# Altium schematic sheet Fly_Buck_Power_Supply_for_Inverter.SchDoc
size A0; SheetNumber: 1; SheetTotal: 1
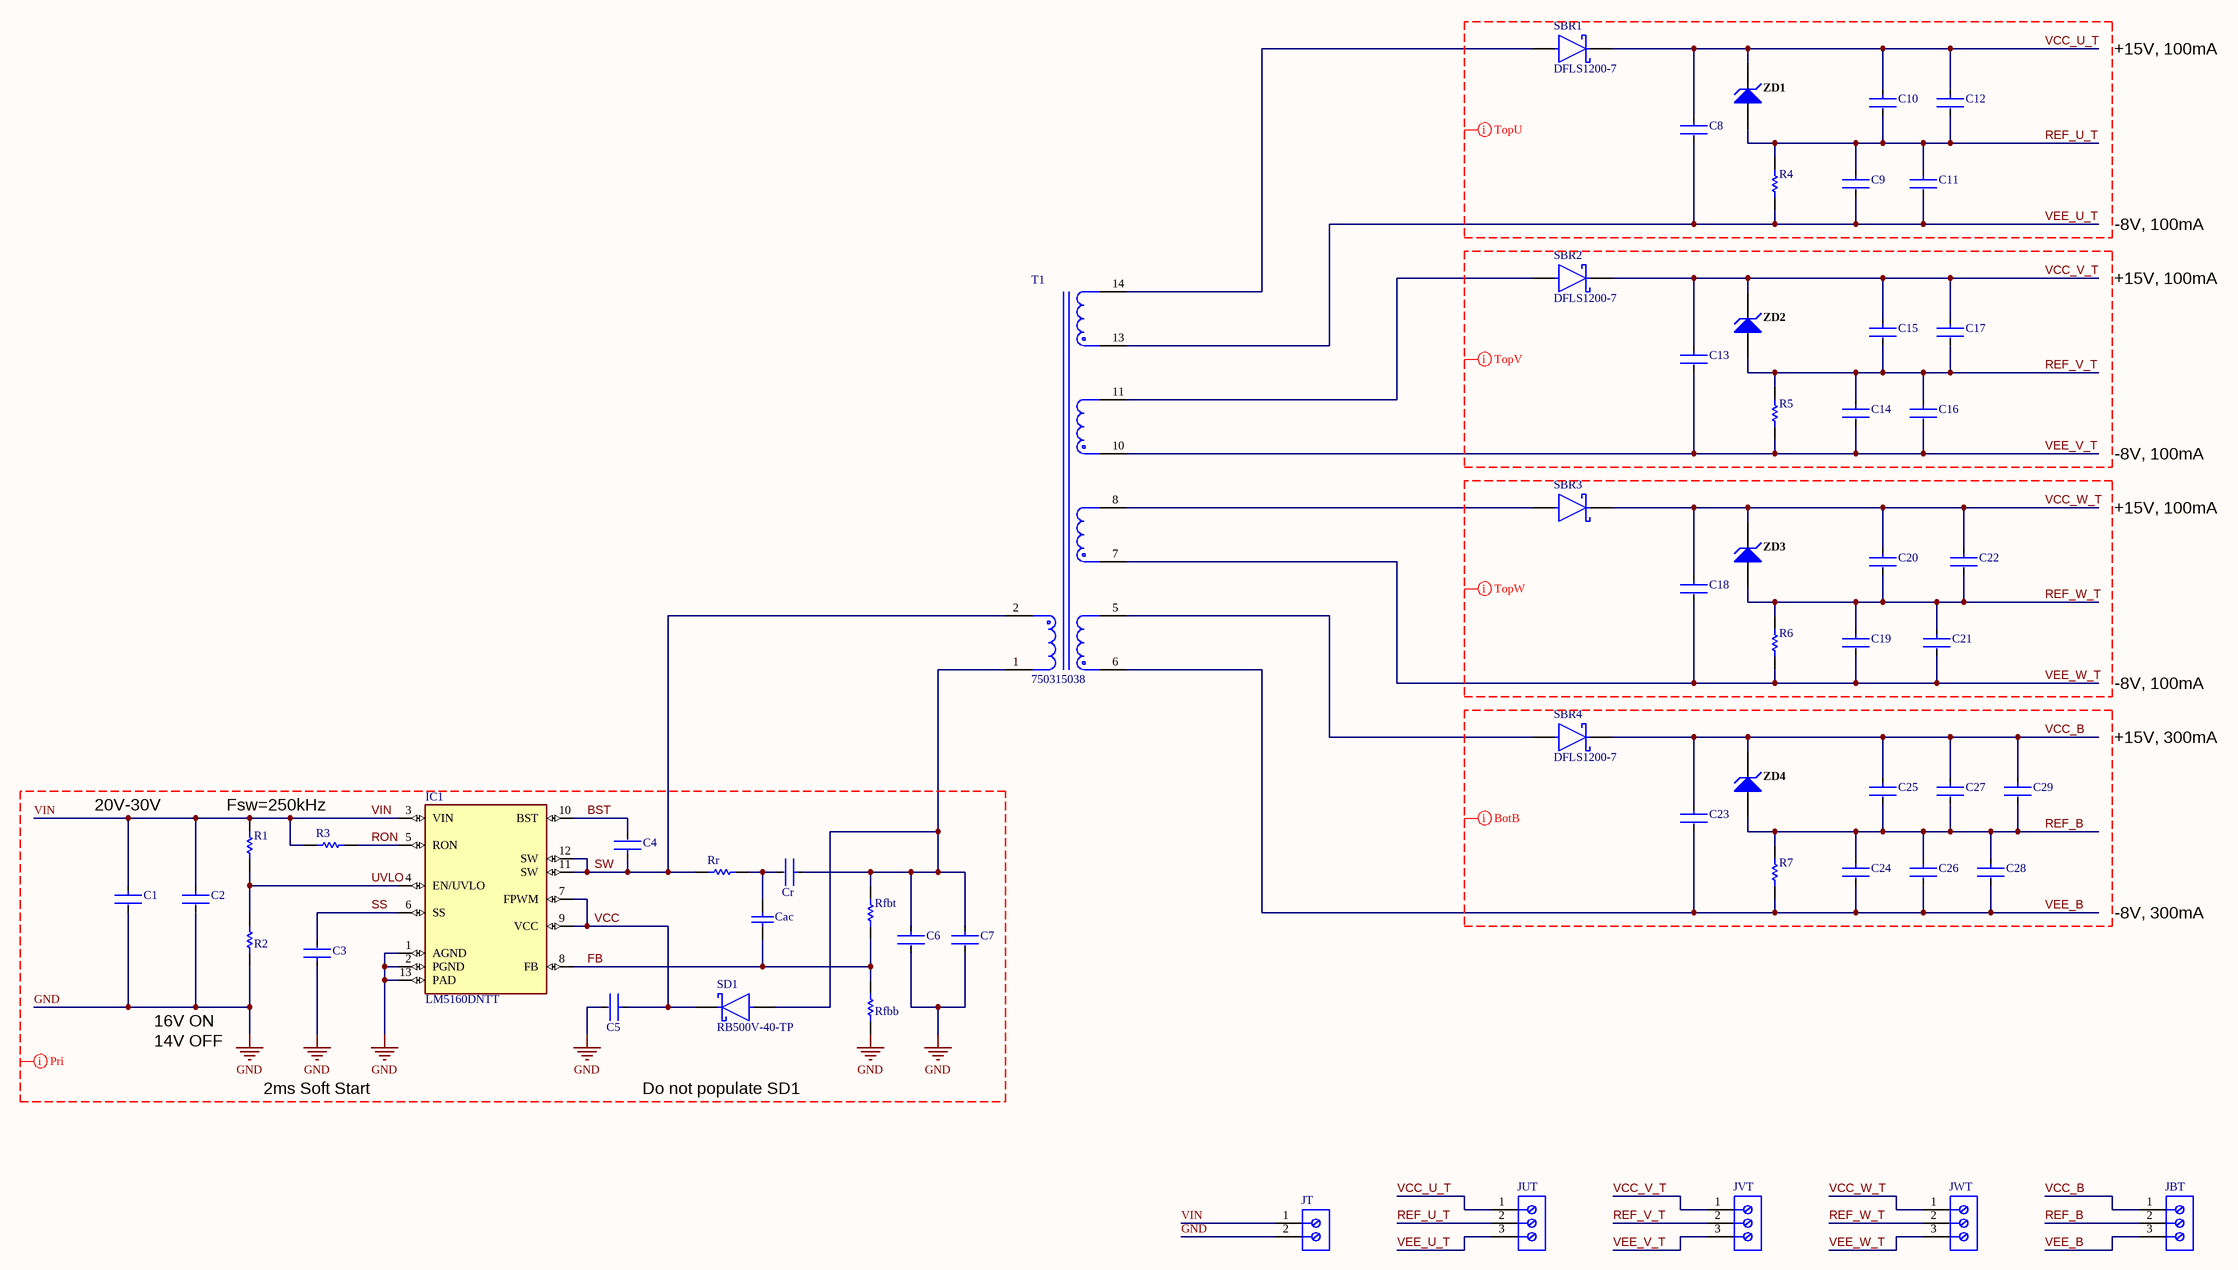
[diagram p0: Fly_Buck_Power_Supply_for_Inverter.SchDoc]

## Parts
C1  GRM32ER71H106KA12L  [FP-GRM32-MFG]  (value not drawn)
C2  C0603X104K5RACTU  [FP-C0603-CJ-MFG]  (value not drawn)
C3  C1608X7R1H103K080AA  [FP-C1608-080-0_1-MFG]  (value not drawn)
C4  C1608X7R1H103K080AA  [FP-C1608-080-0_1-MFG]  (value not drawn)
C5  C1608X5R1E105K080AC  [FP-C1608-080-0_1-MFG]  (value not drawn)
C6  GRM32ER71E226KE15L  [FP-GRM32E-0_3-0_2-IPC_B]  (value not drawn)
C7  GRM32ER71E226KE15L  [FP-GRM32E-0_3-0_2-IPC_B]  (value not drawn)
C8  GRM32ER71H106KA12L  [FP-GRM32-MFG]  (value not drawn)
C9  GRM32ER71E226KE15L  [FP-GRM32E-0_3-0_2-IPC_B]  (value not drawn)
C10  GRM32ER71E226KE15L  [FP-GRM32E-0_3-0_2-IPC_B]  (value not drawn)
C11  C0603X104K5RACTU  [FP-C0603-CJ-MFG]  (value not drawn)
C12  C0603X104K5RACTU  [FP-C0603-CJ-MFG]  (value not drawn)
C13  GRM32ER71H106KA12L  [FP-GRM32-MFG]  (value not drawn)
C14  GRM32ER71E226KE15L  [FP-GRM32E-0_3-0_2-IPC_B]  (value not drawn)
C15  GRM32ER71E226KE15L  [FP-GRM32E-0_3-0_2-IPC_B]  (value not drawn)
C16  C0603X104K5RACTU  [FP-C0603-CJ-MFG]  (value not drawn)
C17  C0603X104K5RACTU  [FP-C0603-CJ-MFG]  (value not drawn)
C18  GRM32ER71H106KA12L  [FP-GRM32-MFG]  (value not drawn)
C19  GRM32ER71E226KE15L  [FP-GRM32E-0_3-0_2-IPC_B]  (value not drawn)
C20  GRM32ER71E226KE15L  [FP-GRM32E-0_3-0_2-IPC_B]  (value not drawn)
C21  C0603X104K5RACTU  [FP-C0603-CJ-MFG]  (value not drawn)
C22  C0603X104K5RACTU  [FP-C0603-CJ-MFG]  (value not drawn)
C23  GRM32ER71H106KA12L  [FP-GRM32-MFG]  (value not drawn)
C24  GRM32ER71E226KE15L  [FP-GRM32E-0_3-0_2-IPC_B]  (value not drawn)
C25  GRM32ER71E226KE15L  [FP-GRM32E-0_3-0_2-IPC_B]  (value not drawn)
C26  GRM32ER71E226KE15L  [FP-GRM32E-0_3-0_2-IPC_B]  (value not drawn)
C27  GRM32ER71E226KE15L  [FP-GRM32E-0_3-0_2-IPC_B]  (value not drawn)
C28  C0603X104K5RACTU  [FP-C0603-CJ-MFG]  (value not drawn)
C29  C0603X104K5RACTU  [FP-C0603-CJ-MFG]  (value not drawn)
Cac  C0603X102K5RACTU  [CAPC1608X87X35NL20T15]  (value not drawn)
Cr  C1608X7R1H103K080AA  [FP-C1608-080-0_1-MFG]  (value not drawn)
IC1  LM5160DNTT  [FP-DNT0012B-IPC_B]
JBT  691214110003  [691214110003]  (value not drawn)
JT  691214110002  [691214110002]  (value not drawn)
JUT  691214110003  [691214110003]  (value not drawn)
JVT  691214110003  [691214110003]  (value not drawn)
JWT  691214110003  [691214110003]  (value not drawn)
R1  RK73H1JTTD1003F  [RESC1608X55X30ML20T10]  (value not drawn)
R2  CRCW06038K45FKEA  [RESC1609X50X30LL10T20]  (value not drawn)
R3  RC0603FR-07453RL  [RESC1608X55X25NL10T15]  (value not drawn)
R4  ERJ-6ENF5110V  [RESC2013X70X40ML20T20]  (value not drawn)
R5  ERJ-6ENF5110V  [RESC2013X70X40ML20T20]  (value not drawn)
R6  ERJ-6ENF5110V  [RESC2013X70X40ML20T20]  (value not drawn)
R7  ERJ-6ENF5110V  [RESC2013X70X40ML20T20]  (value not drawn)
Rfbb  ERA3AEB2052V  [RESC1608X55X30ML20T20]  (value not drawn)
Rfbt  ERJ-3EKF8662V  [RESC1608X55X30NL15T15]  (value not drawn)
Rr  ERA3AEB2052V  [RESC1608X55X30ML20T20]  (value not drawn)
SBR1  DFLS1200-7  [FP-PowerDI123-MFG]
SBR2  DFLS1200-7  [FP-PowerDI123-MFG]
SBR3  DFLS1200-7  [FP-PowerDI123-MFG]  (value not drawn)
SBR4  DFLS1200-7  [FP-PowerDI123-MFG]
SD1  RB500V-40-TP  [FP-SOD-323-MFG]
T1  750315038  [PCBComponent_1]
ZD1  MMSZ5245B-E3-08  [VISH-SOD-123-2_V]  (value not drawn)
ZD2  MMSZ5245B-E3-08  [VISH-SOD-123-2_V]  (value not drawn)
ZD3  MMSZ5245B-E3-08  [VISH-SOD-123-2_V]  (value not drawn)
ZD4  MMSZ5245B-E3-08  [VISH-SOD-123-2_V]  (value not drawn)

## Nets
GND: C1.2 C2.2 C3.2 C5.1 C6.2 C7.2 IC1.1(AGND) IC1.2(PGND) IC1.13(PAD) JT.2 R2.2 Rfbb.2
BST: C4.1 IC1.10(BST)
FB: Cac.2 IC1.8(FB) Rfbb.1 Rfbt.2
REF_B: C24.1 C25.2 C26.1 C27.2 C28.1 C29.2 JBT.2 R7.1 ZD4.1(A)
REF_U_T: C9.1 C10.2 C11.1 C12.2 JUT.2 R4.1 ZD1.1(A)
REF_V_T: C14.1 C15.2 C16.1 C17.2 JVT.2 R5.1 ZD2.1(A)
REF_W_T: C19.1 C20.2 C21.1 C22.2 JWT.2 R6.1 ZD3.1(A)
RON: IC1.5(RON) R3.2
SS: C3.1 IC1.6(SS)
SW: C4.2 IC1.11(SW) IC1.12(SW) Rr.1 T1.2(Secondary_Dot)
UVLO: IC1.4(EN/UVLO) R1.2 R2.1
VCC: C5.2 IC1.7(FPWM) IC1.9(VCC) SD1.1(C)
VCC_B: C23.1 C25.1 C27.1 C29.1 JBT.1 SBR4.1(C) ZD4.2(K)
VCC_U_T: C8.1 C10.1 C12.1 JUT.1 SBR1.1(C) ZD1.2(K)
VCC_V_T: C13.1 C15.1 C17.1 JVT.1 SBR2.1(C) ZD2.2(K)
VCC_W_T: C18.1 C20.1 C22.1 JWT.1 SBR3.1(C) ZD3.2(K)
VEE_B: C23.2 C24.2 C26.2 C28.2 JBT.3 R7.2 T1.6(Secondary_Dot)
VEE_U_T: C8.2 C9.2 C11.2 JUT.3 R4.2 T1.13(Secondary_Dot)
VEE_V_T: C13.2 C14.2 C16.2 JVT.3 R5.2 T1.10(Secondary_Dot)
VEE_W_T: C18.2 C19.2 C21.2 JWT.3 R6.2 T1.7(Secondary_Dot)
VIN: C1.1 C2.1 IC1.3(VIN) JT.1 R1.1 R3.1
NetC6_1: C6.1 C7.1 Cr.2 Rfbt.1 SD1.2(A) T1.1(Primary_Dot)
NetCac_1: Cac.1 Cr.1 Rr.2
NetSBR1_2: SBR1.2(A) T1.14(Primary_Dot)
NetSBR2_2: SBR2.2(A) T1.11(Primary_Dot)
NetSBR3_2: SBR3.2(A) T1.8(Primary_Dot)
NetSBR4_2: SBR4.2(A) T1.5(Primary_Dot)

## Layout directives
mark named BotB: REF_B, VCC_B, VEE_B
mark named TopU: REF_U_T, VCC_U_T, VEE_U_T
mark named TopV: REF_V_T, VCC_V_T, VEE_V_T
mark named TopW: REF_W_T, VCC_W_T, VEE_W_T
mark named Pri: BST, FB, GND, RON, SS, SW, UVLO, VCC, VIN

## Notes on the sheet
- +15V, 100mA
- -8V, 100mA
- +15V, 300mA
- 20V-30V
- (near R1) Fsw=250kHz
- -8V, 300mA
- 16V ON
- 14V OFF
- 2ms Soft Start
- Do not populate SD1

## Library data of the parts
C1 C8 C13 C18 C23 = CMP-2000-05261-2: CAP CER 10µF 50V X7R 1210; Manufacturer: Murata; Tolerance: 10%; Value: 10uF; Material: Ceramic; Temperature Coefficient: 15%; Voltage Rating: 50V; Temperature Characteristic: X7R; ComponentLink2Description: Datasheet; Device Class L1: Passive Components; Lead Free: Yes; Temperature Range High: +125°C; Category: Cap; Manufacturer Part Number: GRM32ER71H106KA12L; ComponentLink2URL: https://search.murata.co.jp/Ceramy/image/img/A01X/G101/ENG/GRM32ER71H106KA12-01.pdf; Device Class L2: Capacitors; Package: GRM32; Mouser Description: 1210 10 uF 50 V ±10% Tolerance X7R SMT Multilayer Ceramic Capacitor; Capacitance: 10uF; Octopart: https://octopart.com/grm32er71h106ka12l-murata-10470987; Digikey Description: CAP CER 10UF 50V X7R 1210; Height: 2.7mm; Temperature: -55°C to +125°C; Temperature Range Low: -55°C; RoHS: TRUE; Device Class L3: Ceramic Capacitors; Automotive: No
C2 C11 C12 C16 C17 C21 C22 C28 C29 = CMP-2006-03300-2: CAP CER 0.1µF 50V X7R 0603; Manufacturer: Kemet; Capacitance: 100nF; Material: Ceramic; Tolerance: 10%; Value: 100nF; Temperature Coefficient: 15%; Temperature Range High: +125°C; Temperature Range Low: -55°C; Manufacturer Part Number: C0603X104K5RACTU; Voltage: 50V; ComponentLink2Description: Datasheet; RoHS: TRUE; ComponentLink2URL: https://content.kemet.com/datasheets/KEM_C1013_X7R_FT-CAP_SMD.pdf; Device Class L3: Ceramic Capacitors; Device Class L2: Capacitors; Package: C0603-CJ; Height: 0.95mm; Device Class L1: Passive Components; Temperature Characteristic: X7R; Lead Free: Yes; Digikey Description: CAP CER 0.1UF 50V X7R 0603; Automotive: No; Mouser Description: Capacitor; Ceramic; Cap 0.1uF; Tol+10%; SMT; Flexible Termination; Vol-Rtg 50V; TR; Temperature: -55°C to +125°C; Octopart: https://octopart.com/c0603x104k5ractu-kemet-9145062; Category: Cap; Voltage Rating: 50V; Ipc Land Pattern Name: CAPC16080X80
C3 C4 Cr = CMP-2000-06026-2: Multilayer Ceramic Capacitors 0.01µF ±10% 50V X7R SMD 0603; Capacitance: 10nF; Voltage: 50V; Depth: 0.8mm; REACH SVHC: No SVHC; Packaging: Tape and Reel; Dielectric Material: Ceramic; Dielectric: X7R; Min Operating Temperature: -55°C; Package Quantity: 1; Width: 0.031inch; Case Code (Imperial): 0603; Radiation Hardening: No; Length: 1.6mm; RoHS Compliant: Yes; Tolerance: 10%; Termination: SMD/SMT; Mount: Surface Mount; Construction: Flat; Resistor Type: Ceramic; Max Operating Temperature: 125°C; Series: C; Lead Free: Lead Free; Voltage Rating (DC): 50V; Thickness: 0.037inch; Voltage Rating: 50V; Height: 0.8mm; Weight: 7.1E-05oz; Case/Package: 0603; Case Code (Metric): 1608
C5 = CMP-08246-002647-1: Multilayer Ceramic Capacitors 1μF ±10% 25V X5R SMD 0603; Capacitance: 1uF; Thickness: 0.037inch; Series: C; Mount: Surface Mount; Packaging: Tape and Reel; Voltage Rating: 25V; RoHS Compliant: Yes; Dielectric: X5R; Dielectric Material: Ceramic; Lead Free: Lead Free; Depth: 0.8mm; Length: 0.063inch; Width: 0.031inch; Resistor Type: Ceramic; Termination: SMD/SMT; Case Code (Imperial): 0603; REACH SVHC: No SVHC; Max Operating Temperature: 85°C; Voltage Rating (DC): 25V; Min Operating Temperature: -55°C; Number of Pins: 2; Case/Package: 0603; Weight: 7.1E-05oz; Tolerance: 10%; Package Quantity: 1; Case Code (Metric): 1608
C6 C7 C9 C10 C14 C15 C19 C20 C24-C27 = CMP-1662-00021-2: Chip Multilayer Ceramic Capacitors for General Purpose, 1210, 22µF, X7R, 15%, 10%, 25V; Capacitance: 22uF; Lead Free: Lead Free; Depth: 2.5mm; Mount: Surface Mount; Termination: SMD/SMT; Radiation Hardening: No; Package Quantity: 1; Dielectric: X7R; REACH SVHC: No SVHC; Voltage: 25V; Voltage Rating: 25V; Case Code (Metric): 3225; Tolerance: 10%; Number of Pins: 2; Packaging: Tape and Reel; Thickness: 0.106inch; Min Operating Temperature: -55°C; Length: 3.2mm; Voltage Rating (DC): 25V; Width: 0.098inch; Height: 2.5mm; Case Code (Imperial): 1210; Max Operating Temperature: 125°C; Material: Ceramic; Case/Package: 1210
Cac = CMP-2006-02994-1: Multilayer Ceramic Capacitor, 1000 pF, 50 V, ± 10%, X7R, 0603 [1608 Metric]; Manufacturer: Kemet; Part Number: C0603X102K5RACTU
IC1 = LM5160DNTT: LM5160 wide input 65V, 2A synchronous buck/Fly-Buck converter 12-WSON -40 to 125
JBT JUT JVT JWT = CMP-1502-02466-2: Conn Terminal Block 3 POS 3.5mm Solder ST Thru-Hole 10A Box; NexarPartId: 18818289; Number of Levels: 1; Voltage: 300V; Pitch: 3.5052mm; Stripping Length: -6mm; Number of Positions Per Level: 3; Plating: Brass, Steel; Wire/Cable Gauge: 24AWG; Wire Gauge (Min): 16AWG; Width: 10.9mm; Length: 7.4mm; Housing Material: Nylon; Height: 12.2mm; Min Operating Temperature: -40°C; Contact Plating: Brass, Tin; Packaging: Box; Color: Blue, Green; Number of Contacts: 3; Number of Pins: 3; Voltage Rating: 300V; Termination: Screw; Lead Pitch: 3.5mm; Current Rating: 10A; Max Operating Temperature: 105°C; Mount: Through Hole; Contact Material: Brass; RoHS: Compliant; Wire Gauge (Max): 24AWG; Current: 10A; REACH SVHC: Unknown
JT = CMP-1502-02464-2: Conn Terminal Block 2 POS 3.5mm Solder ST Thru-Hole 10A Box; NexarPartId: 18818288; Plating: Brass, Steel; Pitch: 3.5052mm; Number of Levels: 1; Number of Contacts: 2; Wire Gauge (Min): 16AWG; Voltage: 300V; Wire Gauge (Max): 24AWG; Stripping Length: -6mm; Number of Pins: 2; Number of Rows: 1; REACH SVHC: Unknown; RoHS: Compliant; Housing Material: Nylon; Current: 10A; Termination: Screw; Mount: Through Hole; Contact Plating: Brass, Tin; Number of Positions Per Level: 2; Color: Blue, Green; Width: 7.9mm; Voltage Rating: 300V; Length: 7.4mm; Current Rating: 10A; Wire/Cable Gauge: 24AWG; Packaging: Box; Max Operating Temperature: 105°C; Lead Pitch: 3.5mm; Height: 8.7mm; Contact Material: Brass; Min Operating Temperature: -40°C
R1 = CMP-2000-01100-1: Res Thick Film 0603 100K Ohm 1% 0.1W(1/10W) ±100ppm/C Pad SMD Automotive T/R; Manufacturer: KOA Speer; Part Number: RK73H1JTTD1003F
R2 = CMP-2000-03623-1: SMD Chip Resistor, 8.45K Ohm, ± 1%, 100 mW, 0603 [1608 Metric], Thick Film, General Purpose; Manufacturer: Vishay Dale; Part Number: CRCW06038K45FKEA
R3 = CMP-2000-04056-1: SMD Chip Resistor, 453 Ohm, ± 1%, 100 mW, 0603 [1608 Metric], Thick Film, General Purpos; Manufacturer: Yageo; Part Number: RC0603FR-07453RL
R4-R7 = CMP-2001-00217-1: SMD Chip Resistor, 511 Ohm, ± 1%, 125 mW, 0805 [2012 Metric], Thick Film, Precision; Manufacturer: Panasonic; Part Number: ERJ-6ENF5110V
Rfbb Rr = CMP-2000-00949-1: Res Thin Film 0603 20.5K Ohm 0.1% 0.1W(1/10W) ±25ppm/C Pad SMD Automotive T/R; Manufacturer: Panasonic; Part Number: ERA3AEB2052V
Rfbt = CMP-2000-00671-1: Manufacturer: Panasonic; Part Number: ERJ-3EKF8662V
SBR1-SBR4 = CMP-2000-07540-2: Rectifier Diode, Schottky, 200V, 1A; Manufacturer: Diodes Inc.; Automotive Grade: Grade 0; Peak Reverse Current: 2uA; Capacitance: 23pF; Value: 23pF; Max Surge Forward Current: 40A; Max Junction Temp: +175°C; Temperature Range Low: -65°C; Mouser Description: Schottky Diodes & Rectifiers SCHOTTKY RECTIFIER; Package: PowerDI123; Footprint Url: https://www.diodes.com/assets/Package-Files/PowerDI123.pdf; Max Repetitive Reverse Voltage: 200V; Device Class L2: Diodes; Temperature Range High: +175°C; Device Class L1: Discrete Semiconductors; ComponentLink2URL: https://www.diodes.com/assets/Datasheets/ds30628.pdf; Category: Diode; Lead Free: Yes; Forward Current: 1A; Manufacturer Part Number: DFLS1200-7; Temperature: -65°C to +175°C; Reverse Voltage: 200V; Height: 1mm; Digikey Description: DIODE SCHOTTKY 200V POWERDI123; RoHS: TRUE; ComponentLink2Description: Datasheet; Device Class L3: Schottky Diodes; Automotive: Yes; Octopart: https://octopart.com/dfls1200-7-diodes+inc.-13134059
SD1 = CMP-56206-000003-1: Rectifier Diode Schottky 45V 0.1A; Max Reverse Voltage (DC): 40V; Max Surge Current: 1A; Average Rectified Current: 100mA; Lead Free: Lead Free; Package Quantity: 1; Packaging: Tape and Reel; Mount: Surface Mount
ZD1-ZD4 = CMP-0931-00033-1: MMSZ5245 Series 15V ±5% 500 mW SMT Small Signal Zener Diode - SOD-123; Manufacturer: Vishay Semiconductor; Int. Construction: Single; Packing: Tape and Reel; Test Current (IZT1) (mA): 8.5; Zener Impedance (IZT1) (Max.) (Ohm): 16; Zener Voltage (NOM.) (V): 15; Power Dissipation (mW): 500; Tolerance: +/- 5%; PackageDescription: 2-Pin SMD, Body 2.7 x 1.55 mm, Height 1.35 mm; ComponentLink2Description: Datasheet; PackageVersion: Rev. 1.9; ComponentLink2URL: http://www.vishay.com/docs/85774/mmsz5225.pdf; RoHS: TRUE; Operating Temperature: -55 to 150 degC; ComponentLink1Description: Manufacturer URL; ComponentLink3Description: Package Specification; PackageReference: SOD-123-2; DatasheetVersion: Rev. 1.9; PartNumber: MMSZ5245B-E3-08; ComponentLink3URL: http://www.vishay.com/docs/85774/mmsz5225.pdf; Mounting Technology: Surface Mount; ComponentLink1URL: http://www.vishay.com/